# EAGLE design CANshield (EAGLE 5.10)
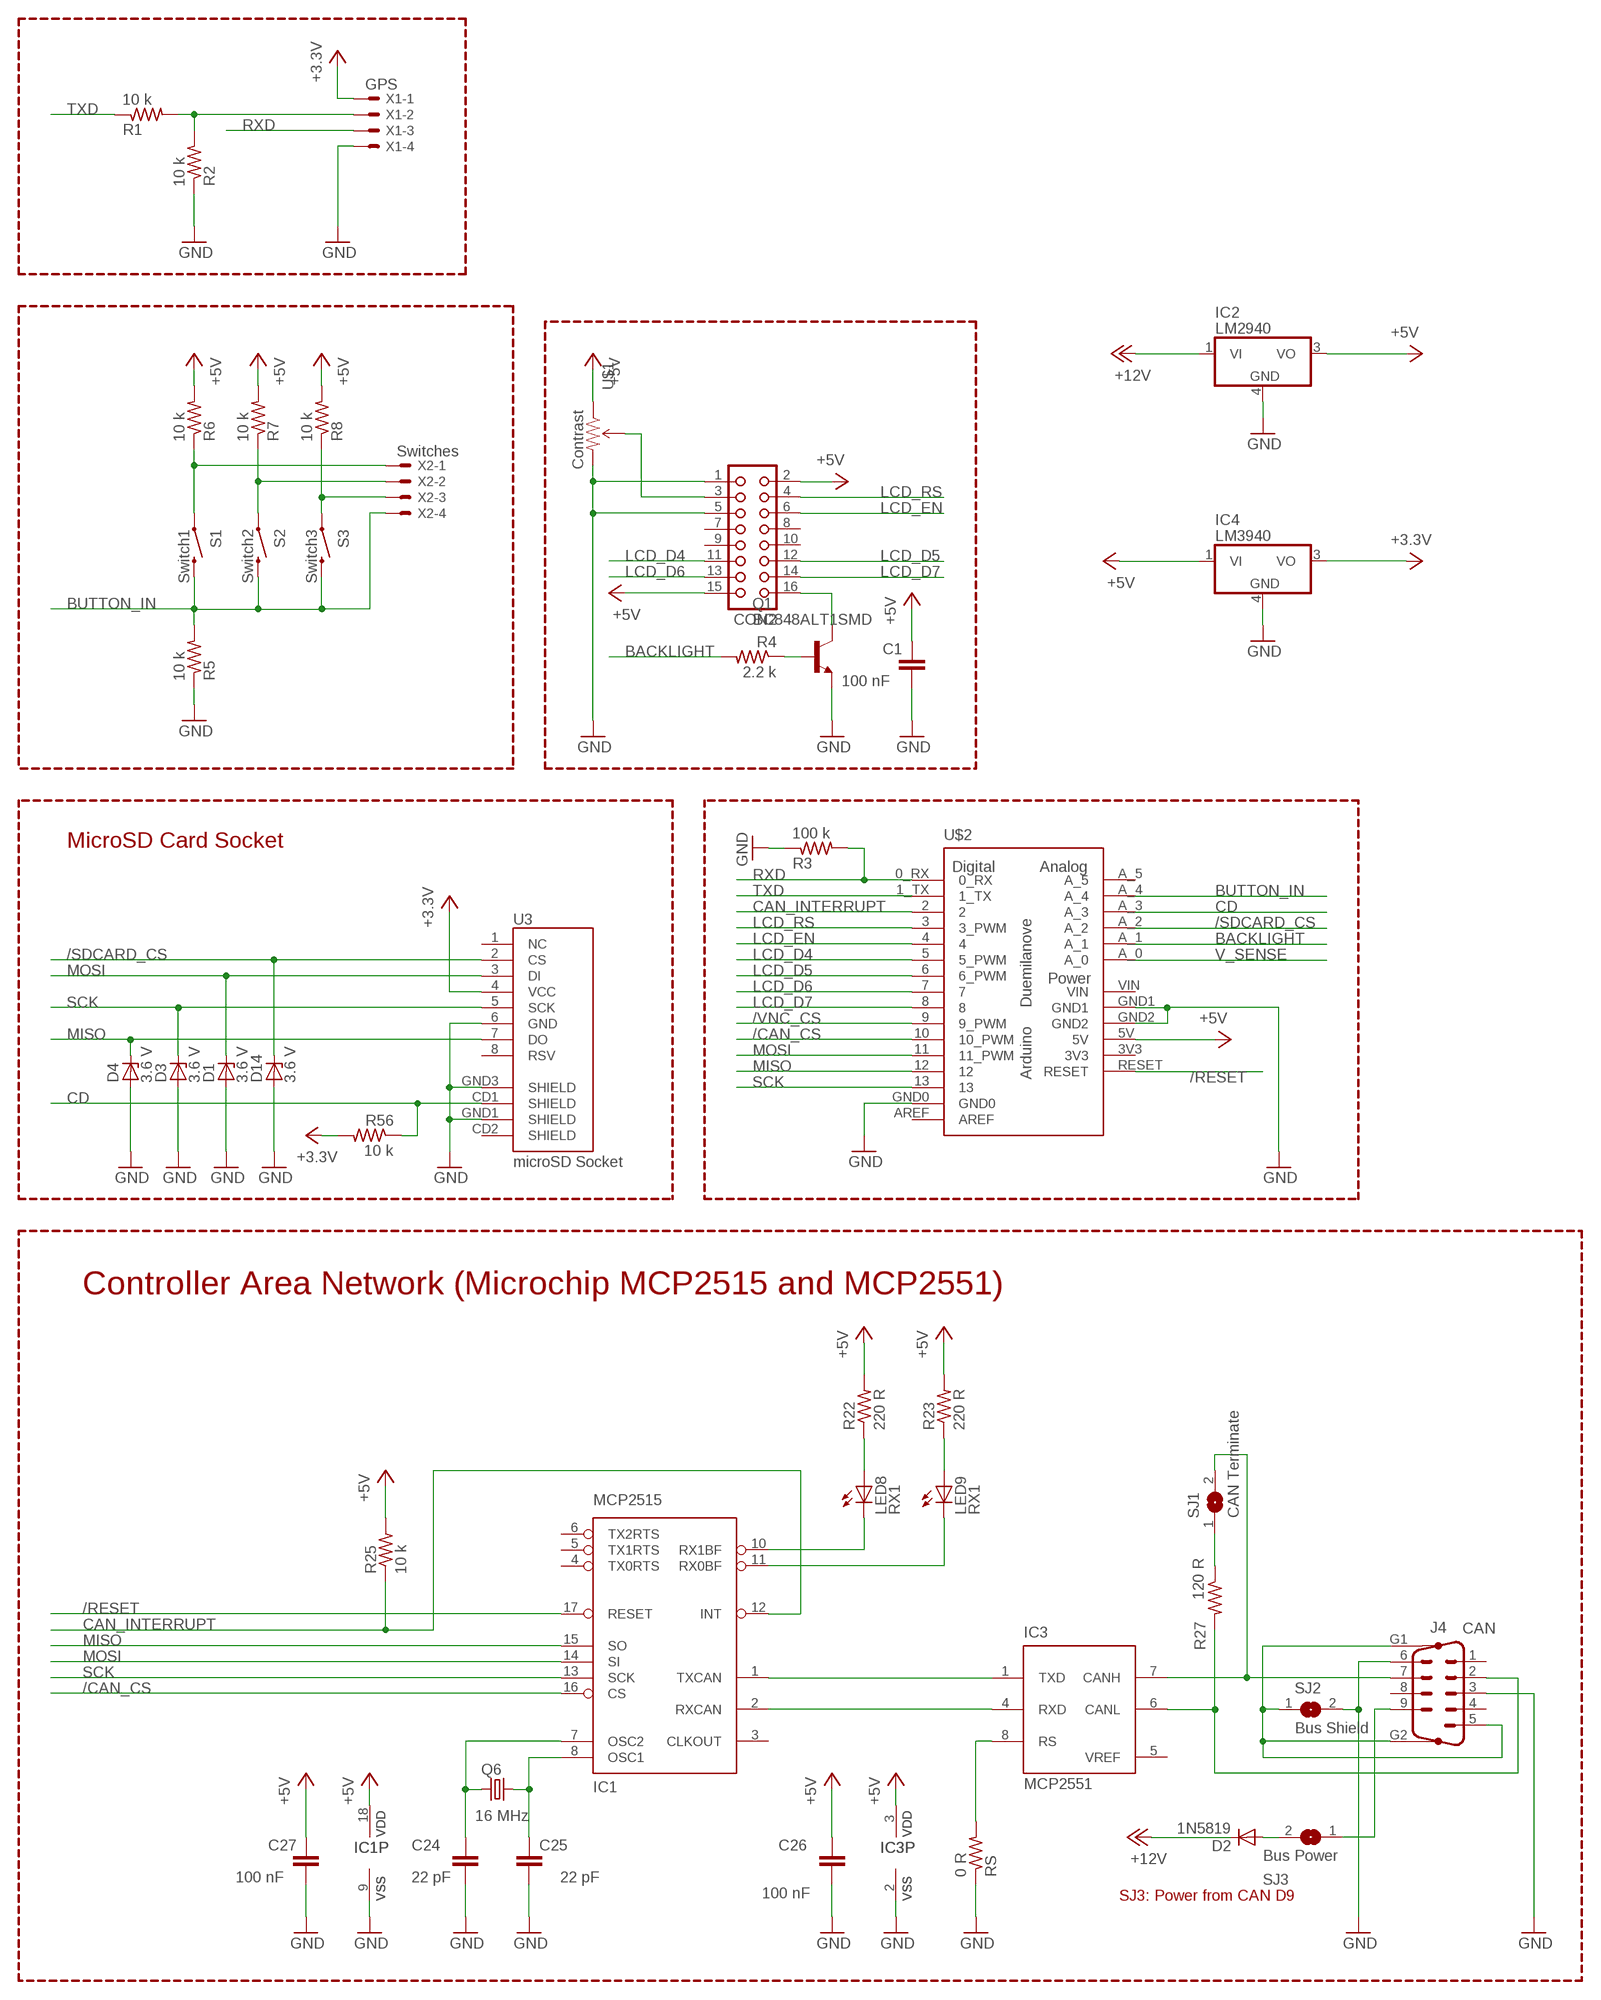
[diagram p0: schematic, sheet 1]

## Parts
C1  100 nF  C-EUC0805  [C0805]
C24  22 pF  C-EUC0805  [C0805]
C25  22 pF  C-EUC0805  [C0805]
C26  100 nF  C-EUC0805  [C0805]
C27  100 nF  C-EUC0805  [C0805]
CON2  CON16L  [CON16L]
D1  3.6 V  ZENER-DIODESOD80C  [SOD80C]
D2  1N5819  DIODE-SOD123  [SOD123]
D3  3.6 V  ZENER-DIODESOD80C  [SOD80C]
D4  3.6 V  ZENER-DIODESOD80C  [SOD80C]
D14  3.6 V  ZENER-DIODESOD80C  [SOD80C]
IC1  MCP2515  MCP2510SO  [SO-18W]
IC2  LM2940  LM340MP-05  [SOT223]
IC3  MCP2551  MCP2551SN  [SO-08]
IC4  LM3940  LM340MP-05  [SOT223]
J4  CAN  M09HP  [M09HP]
LED8  RX1  LEDCHIP-LED0805  [CHIP-LED0805]
LED9  RX1  LEDCHIP-LED0805  [CHIP-LED0805]
Q1  BC848ALT1SMD  [SOT23]
Q6  16 MHz  CRYSTALHC49UP  [HC49UP]
R1  10 k  R-US_M0805  [M0805]
R2  10 k  R-US_M0805  [M0805]
R3  100 k  R-US_M0805  [M0805]
R4  2.2 k  R-US_M0805  [M0805]
R5  10 k  R-US_M0805  [M0805]
R6  10 k  R-US_M0805  [M0805]
R7  10 k  R-US_M0805  [M0805]
R8  10 k  R-US_M0805  [M0805]
R22  220 R  R-US_M0805  [M0805]
R23  220 R  R-US_M0805  [M0805]
R25  10 k  R-US_M0805  [M0805]
R27  120 R  R-US_M0805  [M0805]
R56  10 k  R-US_M0805  [M0805]
RS  0 R  R-US_M0805  [M0805]
S1  Switch1  SWITCH-MOMENTARY-2SMD  [TACTILE_SWITCH_SMD]
S2  Switch2  SWITCH-MOMENTARY-2SMD  [TACTILE_SWITCH_SMD]
S3  Switch3  SWITCH-MOMENTARY-2SMD  [TACTILE_SWITCH_SMD]
SJ1  CAN Terminate  SJ  [SJ]
SJ2  Bus Shield  SJ  [SJ]
SJ3  Bus Power  SJ  [SJ]
U3  microSD Socket  USD-SOCKETNEW  [MICRO-SD-SOCKET-PP]
U$1  Contrast  TRIMPOTSMD  [TRIMPOT-3MM]
U$2  ARDUINO-USBLONG_PADS_TEXT  [SHIELD]
X1  GPS  22-23-2041  [22-23-2041]
X2  Switches  22-23-2041  [22-23-2041]

## Nets
+3V3: IC4.3(VO) R56.2 U3.4(VCC) X1.1 ; supply symbol labelled +3.3V
+5V: C1.2 C26.2 C27.2 CON2.2 CON2.15 IC1.18(VDD) IC2.3(VO) IC3.3(VDD) IC4.1(VI) R6.2 R7.2 R8.2 R22.2 R23.2 R25.2 U$1.1(CCW) U$2.5V
+12V: D2.C IC2.1(VI)
/CAN_CS: IC1.16(CS) U$2.10(10_PWM)
/RESET: IC1.17(RESET) U$2.RESET
/SDCARD_CS: D14.C U3.2(CS) U$2.A_2
/VNC_CS: U$2.9(9_PWM)
BACKLIGHT: R4.2 U$2.A_1
BUTTON_IN: R5.2 S1.3 S2.3 S3.3 U$2.A_4 X2.4
CAN_INTERRUPT: IC1.12(INT) R25.1 U$2.2
CD: U3.CD1(SHIELD) U$2.A_3
GND: C1.1 C24.1 C25.1 C26.1 C27.1 CON2.1 CON2.5 D1.A D3.A D4.A D14.A IC1.9(VSS) IC2.4(GND) IC3.2(VSS) IC4.4(GND) J4.3 J4.6 Q1.2(E) R2.1 R3.1 R5.1 RS.1 SJ2.2 U3.6(GND) U3.GND1(SHIELD) U3.GND3(SHIELD) U$1.3(CW) U$2.GND0 U$2.GND1 U$2.GND2 X1.4
GPS_RX: R1.2 R2.2 X1.2
LCD_D4: CON2.11 U$2.5(5_PWM)
LCD_D5: CON2.12 U$2.6(6_PWM)
LCD_D6: CON2.13 U$2.7
LCD_D7: CON2.14 U$2.8
LCD_EN: CON2.6 U$2.4
LCD_RS: CON2.4 U$2.3(3_PWM)
MISO: D4.C IC1.15(SO) U3.7(DO) U$2.12
MOSI: D1.C IC1.14(SI) U3.3(DI) U$2.11(11_PWM)
N$3: Q1.1(B) R4.1
N$4: R6.1 S1.1 X2.1
N$5: CON2.3 U$1.2(WIPER)
N$6: R7.1 S2.1 X2.2
N$7: R8.1 S3.1 X2.3
N$9: CON2.16 Q1.3(C)
N$11: R56.1
N$77: IC1.1(TXCAN) IC3.1(TXD)
N$78: IC1.2(RXCAN) IC3.4(RXD)
N$85: C25.2 IC1.8(OSC1) Q6.1
N$88: C24.2 IC1.7(OSC2) Q6.2
N$89: IC1.11(RX0BF) LED9.C
N$90: IC1.10(RX1BF) LED8.C
N$91: LED9.A R23.1
N$92: LED8.A R22.1
N$93: IC3.8(RS) RS.2
N$94: IC3.7(CANH) J4.7 SJ1.2
N$95: IC3.6(CANL) J4.2 R27.2
N$101: J4.5 J4.G1 J4.G2 SJ2.1
N$111: J4.9 SJ3.1
N$112: D2.A SJ3.2
N$123: R27.1 SJ1.1
RXD: R3.2 U$2.0_RX X1.3
SCK: D3.C IC1.13(SCK) U3.5(SCK) U$2.13
TXD: R1.1 U$2.1_TX
V_SENSE: U$2.A_0
Unconnected: CON2.7 CON2.8 CON2.9 CON2.10 IC1.3(CLKOUT) IC1.4(TX0RTS) IC1.5(TX1RTS) IC1.6(TX2RTS) J4.1 J4.4 J4.8 U3.1(NC) U3.8(RSV) U3.CD2(SHIELD) U$2.A_5 U$2.AREF

## Notes on the sheet
- MicroSD Card Socket
- Controller Area Network (Microchip MCP2515 and MCP2551)
- SJ3: Power from CAN D9

## Power pins joined to a net without a drawn wire
3V3: U$2.3V3
VIN: U$2.VIN
VREF: IC3.5(VREF)

## Library data of the parts
C1 C24-C27 = rcl:C-EU: CAPACITOR, European symbol
CON2 = con-harting:CON16L: CONNECTOR
D1 D3 D4 D14 = diode:ZENER-DIODE: Z-Diode
D2 = diode:DIODE-: DIODE
IC1 = microchip_can:MCP2510
IC2 IC4 = linear:LM340?-*: Positive VOLTAGE REGULATOR Source: http://cache.national.com/ds/LM/LM340.pdf
IC3 = microchip_can:MCP2551: High Speed CAN tranceiver
J4 = con-subd:M09HP: SUB-D
LED8 LED9 = led:LED: LED OSRAM: - CHIPLED LG R971, LG N971, LY N971, LG Q971, LY Q971, LO R971, LY R971 LH N974, LH R974 LS Q976, LO Q976, LY Q976 LO Q996 - Hyper CHIPLED LW Q18S LB Q993, LB Q99A, LB R99A - SideLED LS A670, LO A670, LY A670, LG A670, LP A670 LB A673, LV A673, LT A673, LW A673 LH A674 LY A675 LS A676, LA A676, LO A676, LY A676, LW A676 LS A679, LY A679, LG A679 - Hyper Micro SIDELED® LS Y876, LA Y876, LO Y876, LY Y876 LT Y87S - SmartLED LW L88C, LW L88S LB L89C, LB L89S, LG L890 LS L89K, LO L89K, LY L89K LS L896, LA L896, LO L896, LY L896 - TOPLED LS T670, LO T670, LY T670, LG T670, LP T670 LSG T670, LSP T670, LSY T670, LOP T670, LYG T670 LG T671, LOG T671, LSG T671 LB T673, LV T673, LT T673, LW T673 LH T674 LS T676, LA T676, LO T676, LY T676, LB T676, LH T676, LSB T676, LW T676 LB T67C, LV T67C, LT T67C, LS T67K, LO T67K, LY T67K, LW E67C LS E67B, LA E67B, LO E67B, LY E67B, LB E67C, LV E67C, LT E67C LW T67C LS T679, LY T679, LG T679 LS T770, LO T770, LY T770, LG T770, LP T770 LB T773, LV T773, LT T773, LW T773 LH T774 LS E675, LA E675, LY E675, LS T675 LS T776, LA T776, LO T776, LY T776, LB T776 LHGB T686 LT T68C, LB T68C - Hyper Mini TOPLED® LB M676 - Mini TOPLED Santana® LG M470 LS M47K, LO M47K, LY M47K Source: http://www.osram.convergy.de LUXEON: - LUMILED® LXK2-PW12-R00, LXK2-PW12-S00, LXK2-PW14-U00, LXK2-PW14-V00 LXK2-PM12-R00, LXK2-PM12-S00, LXK2-PM14-U00 LXK2-PE12-Q00, LXK2-PE12-R00, LXK2-PE12-S00, LXK2-PE14-T00, LXK2-PE14-U00 LXK2-PB12-K00, LXK2-PB12-L00, LXK2-PB12-M00, LXK2-PB14-N00, LXK2-PB14-P00, LXK2-PB14-Q00 LXK2-PR12-L00, LXK2-PR12-M00, LXK2-PR14-Q00, LXK2-PR14-R00 LXK2-PD12-Q00, LXK2-PD12-R00, LXK2-PD12-S00 LXK2-PH12-R00, LXK2-PH12-S00 LXK2-PL12-P00, LXK2-PL12-Q00, LXK2-PL12-R00 Source: www.luxeon.com KINGBRIGHT: KA-3528ASYC Source: www.kingbright.com
Q1 = transistor-npn:BC848*: NPN Transistor
Q6 = crystal:CRYSTAL: CRYSTAL
R1-R8 R22 R23 R25 R27 R56 RS = rcl:R-US_: RESISTOR, American symbol
S1-S3 = SparkFun:SWITCH-MOMENTARY-2
SJ1-SJ3 = jumper:SJ: SMD solder JUMPER
U3 = SparkFun:USD-SOCKET: microSD Socket Push-push type uSD socket. Schematic element and footprint production proven. Spark Fun Electronics SKU : PRT-00127. tDoc lines correctly indicate media card edge positions when inserting (unlocked, locked, depressed).
U$1 = SparkFun:TRIMPOT
U$2 = Arduino-Various:ARDUINO-USB: The Ardiuno Duemilanove Pinouts layoutet as a Bare Shield. v0.5 Also for Arduino Diecimila. This is designed as a Part and has no Outline in the Dimension Layer. The Outline, when present, is drawed at the tPlace / bPlace Layer. Library by Stephanie Lange, http://www.k-ita.de/~sl/
X1 X2 = con-molex:22-23-2041: .100" (2.54mm) Center Header - 4 Pin

## Board
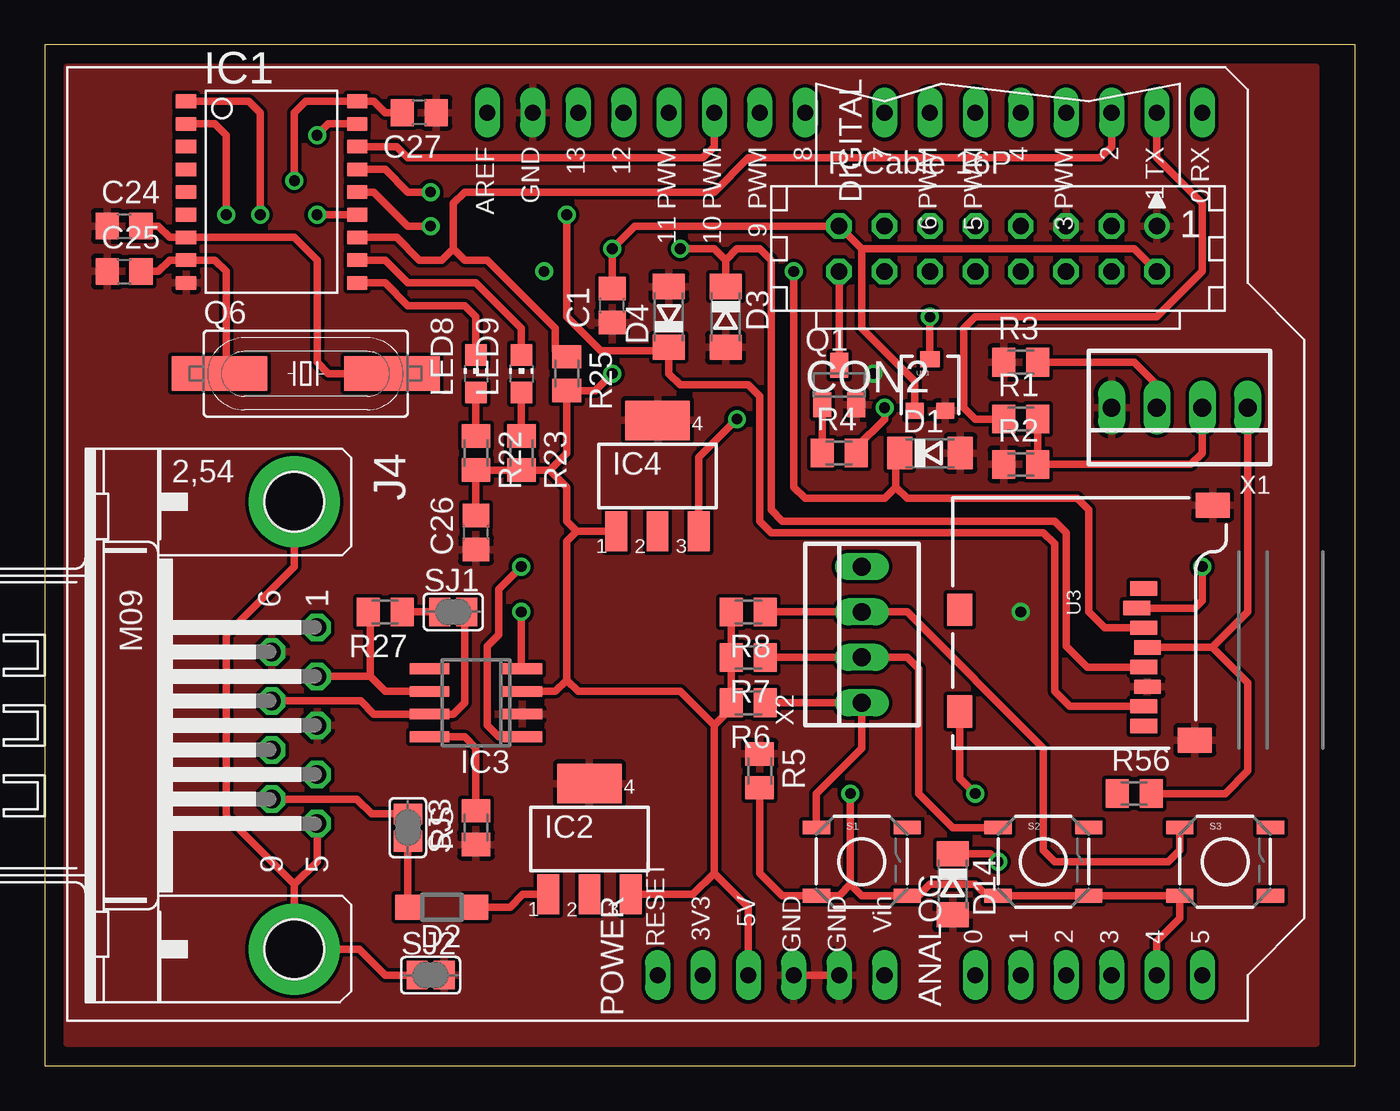
[diagram p1: board, top side]
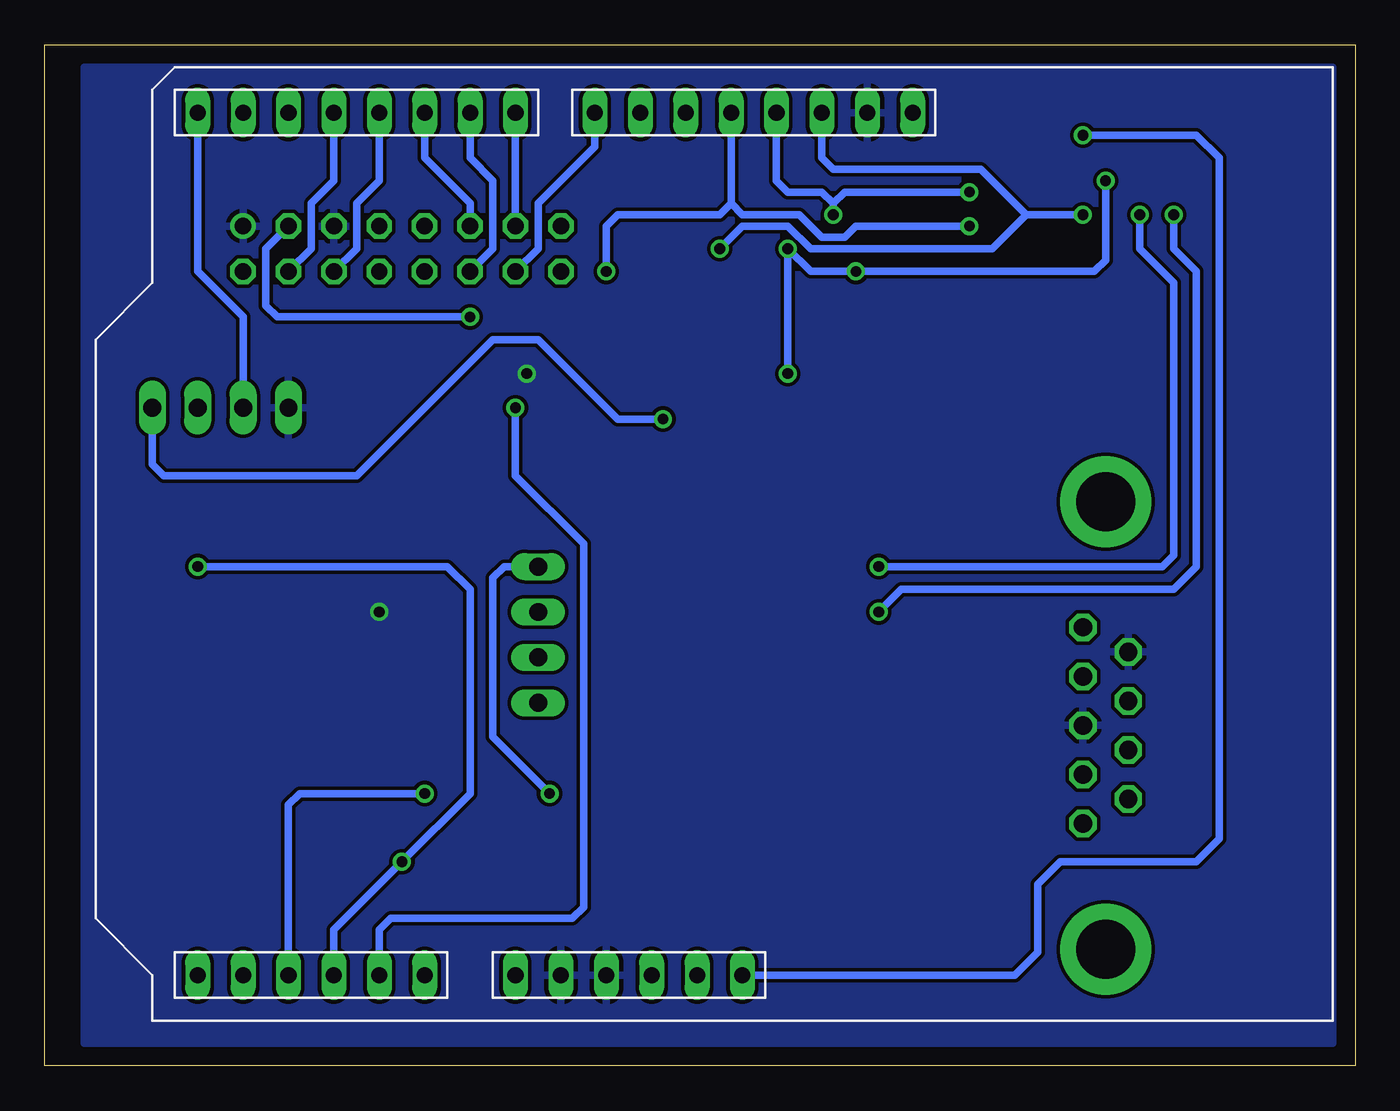
[diagram p2: board, bottom side, seen from below]

Size 73.33 x 57.14 mm. Coordinates in mm from the lower left corner, seen from the top.
Outline: 0,0 73.33,0 73.33,57.14 0,57.14 0,0
Copper layers (1*16): Top 0.035mm / dielectric 1.5mm / Bottom 0.035mm
Design rules "default": minimum track width 10mil, minimum drill 24mil, track to track 8mil, track to pad 8mil, pad to pad 8mil, via to via 8mil, smd to smd 8mil, copper to edge 40mil, drill to drill 8mil, minimum pad ring 10mil, minimum via ring 8mil, stop-mask expansion 4mil, vias tented up to drill 0mil, thermal gap 10mil

### Footprints (pad centres in the part's own frame; a part is rotated, then mirrored left to right if it is on the bottom)
C0805 = smd 1.3 x 1.5: 1 -0.95,0; 2 0.95,0
CON16L = drill 0.914 round: 1 8.89,1.27 | drill 0.914 octagon: 2 8.89,-1.27; 3 6.35,1.27; 4 6.35,-1.27; 5 3.81,1.27; 6 3.81,-1.27; 7 1.27,1.27; 8 1.27,-1.27; 9 -1.27,1.27; 10 -1.27,-1.27; 11 -3.81,1.27; 12 -3.81,-1.27; 13 -6.35,1.27; 14 -6.35,-1.27; 15 -8.89,1.27; 16 -8.89,-1.27
SOD80C = smd 1.4 x 1.8: A 1.7,0; C -1.7,0
SOD123 = smd 1.4 x 1.4: A 1.9,0; C -1.9,0
SO-18W = smd 0.762 x 1.143: 1 -5.08,-4.788; 2 -3.81,-4.788; 3 -2.54,-4.788; 4 -1.27,-4.788; 5 0,-4.788; 6 1.27,-4.788; 7 2.54,-4.788; 8 3.81,-4.788; 9 5.08,-4.788; 10 5.08,4.788; 11 3.81,4.788; 12 2.54,4.788; 13 1.27,4.788; 14 0,4.788; 15 -1.27,4.788; 16 -2.54,4.788; 17 -3.81,4.788; 18 -5.08,4.788
SOT223 = smd 1.219 x 2.235: 1 -2.311,-3.099; 2 0,-3.099; 3 2.311,-3.099 | smd 3.6 x 2.2: 4 0,3.099
SO-08 = smd 0.6 x 2.2: 1 -1.905,-2.6; 2 -0.635,-2.6; 3 0.635,-2.6; 4 1.905,-2.6; 5 1.905,2.6; 6 0.635,2.6; 7 -0.635,2.6; 8 -1.905,2.6
M09HP = drill 1.016 octagon: 1 -5.486,1.27; 2 -2.743,1.27; 3 0,1.27; 4 2.743,1.27; 5 5.486,1.27; 6 -4.115,-1.27; 7 -1.372,-1.27; 8 1.372,-1.27; 9 4.115,-1.27 | drill 3.302 pad 5.08 round: G1 -12.522,0; G2 12.522,0
CHIP-LED0805 = smd 1.2 x 1.2: A 0,-1.05; C 0,1.05
SOT23 = smd 1 x 1.4: 1 -0.95,-1.1; 2 0.95,-1.1; 3 0,1.1
HC49UP = smd 5.334 x 1.93: 1 -4.826,0; 2 4.826,0
M0805 = smd 1.3 x 1.6: 1 -0.95,0; 2 0.95,0
TACTILE_SWITCH_SMD = smd 1.524 x 0.762: 1 -2.54,1.905; 2 2.54,1.905; 3 -2.54,-1.905; 4 2.54,-1.905
SJ = smd 1.168 x 1.6: 1 -0.762,0; 2 0.762,0
MICRO-SD-SOCKET-PP = smd 0.8 x 1.5: 1 -8.94,10.7; 2 -7.84,10.3; 3 -6.74,10.7; 4 -5.64,10.9; 5 -4.54,10.7; 6 -3.44,10.9; 7 -2.34,10.7; 8 -1.24,10.7 | smd 1.8 x 1.4: CD1 -2.05,0.4; CD2 -7.75,0.4 | smd 1.4 x 1.9: GND1 -13.6,14.55; GND3 -0.45,13.55
TRIMPOT-3MM = smd 1 x 0.9: 1 -0.85,-1.45; 3 0.85,-1.45 | smd 1.1 x 0.9: 2 0,1.45
SHIELD = drill 0.9 pad 1.27 long: 0_RX -25.4,27.94; 1_TX -25.4,25.4; 2 -25.4,22.86; 3 -25.4,20.32; 3V3 22.86,0; 4 -25.4,17.78; 5 -25.4,15.24; 5V 22.86,2.54; 6 -25.4,12.7; 7 -25.4,10.16; 8 -25.4,5.715; 9 -25.4,3.175; 10 -25.4,0.635; 11 -25.4,-1.905; 12 -25.4,-4.445; 13 -25.4,-6.985; A_0 22.86,15.24; A_1 22.86,17.78; A_2 22.86,20.32; A_3 22.86,22.86; A_4 22.86,25.4; A_5 22.86,27.94; AREF -25.4,-12.065; GND0 -25.4,-9.525; GND1 22.86,7.62; GND2 22.86,5.08; RESET 22.86,-2.54; VIN 22.86,10.16
22-23-2041 = drill 1 long: 1 -3.81,0; 2 -1.27,0; 3 1.27,0; 4 3.81,0

### Placement (x,y rotation side)
C1  31.75,42.54 90 top
C24  4.45,46.99 0 top
C25  4.45,44.45 0 top
C26  24.13,29.84 90 top
C27  20.96,53.34 180 top
CON2  53.34,45.72 0 top
D1  49.53,34.29 0 top
D2  22.23,8.89 180 top
D3  38.1,41.91 270 top
D4  34.92,41.91 90 top
D14  50.8,10.16 270 top
IC1  12.7,48.89 270 top
IC2  30.48,12.7 0 top
IC3  24.13,20.32 90 top
IC4  34.29,33.02 0 top
J4  13.97,19.05 270 top
LED8  24.13,38.73 0 top
LED9  26.67,38.73 0 top
Q1  44.45,38.1 0 top
Q6  14.61,38.73 0 top
R1  54.61,36.2 0 top
R2  54.61,33.65 0 top
R3  54.61,39.37 0 top
R4  44.45,34.29 0 top
R5  40,16.51 270 top
R6  39.37,20.32 180 top
R7  39.37,22.86 180 top
R8  39.37,25.4 180 top
R22  24.13,34.29 270 top
R23  26.67,34.29 270 top
R25  29.21,38.73 270 top
R27  19.05,25.4 180 top
R56  60.96,15.24 0 top
RS  24.13,13.34 90 top
S1  45.72,11.43 0 top
S2  55.88,11.43 0 top
S3  66.04,11.43 0 top
SJ1  22.86,25.4 0 top
SJ2  21.59,5.08 0 top
SJ3  20.32,13.34 270 top
U3  50.8,17.78 270 top
U$1  49.53,38.1 0 top
U$2  36.83,27.94 270 top
X1  63.5,36.83 180 top
X2  45.72,24.13 90 top

### Tracks (layer width: path | path; a pad name or v marks a point on that pad's centre or on a via)
+3V3  (via drill 0.6)
  Top 0.406: 65.33,23.42 U3.4 | 65.33,23.42 67.31,25.4 X1.1 | R56.2 66.04,15.24 67.31,16.51 67.31,21.44 65.33,23.42 | IC4.3 36.6,34.06 v38.73,36.2
  Bottom 0.406: v38.73,36.2 41.27,36.2 45.72,40.64 48.26,40.64 55.88,33.02 66.67,33.02 67.31,33.65 X1.1
+5V  (via drill 0.6)
  Top 0.406: C27.2 19.05,53.34 18.41,53.97 IC1.18 14.61,53.97 13.97,53.34 v13.97,49.53 | 28.26,33.34 R23.2 R22.2 C26.2 | 28.26,33.34 29.21,34.29 R25.2 30.8,37.78 v31.75,38.73 | 45.72,45.72 CON2.15 33.02,46.99 v31.75,45.72 C1.2 | 45.72,45.72 60.96,45.72 CON2.2 | 28.26,33.34 29.21,32.39 29.21,30.48 29.77,29.92 | 29.21,21.59 28.57,20.96 IC3.3 | 45.72,45.72 45.72,41.27 48.68,38.31 U$1.1 | R8.2 R7.2 R6.2 38.42,20 37.46,19.05 | U$2.5V 39.37,8.89 37.46,10.79 | 37.46,10.79 37.46,19.05 | 29.21,21.59 29.84,20.96 35.56,20.96 37.46,19.05 | 29.77,29.92 IC4.1 | 29.21,21.59 29.21,29.36 29.77,29.92 | IC2.3 36.27,9.6 37.46,10.79
  Bottom 0.406: v13.97,49.53 13.97,45.08 14.61,44.45 v27.94,44.45 30.48,44.45 v31.75,45.72 v31.75,38.73
+12V
  Top 0.406: D2.C 26.04,8.89 26.75,9.6 IC2.1
/CAN_CS
  Top 0.406: IC1.16 19.68,51.43 20.32,50.8 36.83,50.8 37.46,51.43 U$2.10
/RESET  (via drill 0.6)
  Top 0.406: IC1.17 15.88,52.7 v15.24,52.07
  Bottom 0.406: U$2.RESET 19.05,5.08 17.78,6.35 17.78,10.16 16.51,11.43 8.89,11.43 7.62,12.7 7.62,50.8 8.89,52.07 v15.24,52.07
/SDCARD_CS  (via drill 0.6)
  Top 0.406: U3.2 64.36,25.62 64.77,26.04 v64.77,27.94 | D14.C 52.91,11.86 v53.34,11.43
  Bottom 0.406: U$2.A_2 57.15,7.62 v53.34,11.43 49.53,15.24 49.53,26.67 50.8,27.94 v64.77,27.94
BACKLIGHT  (via drill 0.6)
  Top 0.406: R4.2 45.4,34.6 46.99,36.2 v46.99,36.83
  Bottom 0.406: v46.99,36.83 46.99,33.02 43.18,29.21 43.18,8.89 43.81,8.26 53.97,8.26 54.61,7.62 U$2.A_1
BUTTON_IN  (via drill 0.6)
  Top 0.406: U$2.A_4 62.23,6.99 63.5,8.26 S3.3 S2.3 52.7,9.53 52.07,10.16 49.53,10.16 48.89,9.53 45.72,9.53 45.08,10.16 | 45.08,10.16 v45.08,15.24 | 45.08,10.16 44.45,9.53 S1.3 41.27,9.53 40,10.79 R5.2
  Bottom 0.406: X2.4 47.62,27.94 48.26,27.3 48.26,18.41 v45.08,15.24
CAN_INTERRUPT
  Top 0.406: U$2.2 59.69,51.43 59.05,50.8 39.37,50.8 37.46,48.89 23.5,48.89 22.86,48.26 22.86,45.72 | 22.86,45.72 23.5,45.08 24.77,45.08 28.57,41.27 28.57,40 28.89,39.68 R25.1 | 22.86,45.72 22.23,45.08 20.96,45.08 19.68,46.35 IC1.12
CD  (via drill 0.6)
  Top 0.406: U3.CD1 51.2,16.11 v52.07,15.24
  Bottom 0.406: v52.07,15.24 59.05,15.24 59.69,14.61 U$2.A_3
GND  (via drill 0.6)
  Top 0.406: U$2.GND2 U$2.GND1
  other vias: 46.35,38.73 54.61,25.4
  pour Bottom: 1.27,55.88 71.12,55.88 71.12,1.27 1.27,1.27
  pour Top: 1.27,55.88 71.12,55.88 71.12,1.27 1.27,1.27
GPS_RX
  Top 0.406: X1.2 64.77,34.29 64.14,33.65 R2.2 R1.2
LCD_D4
  Bottom 0.406: CON2.11 49.53,48.26 52.07,50.8 U$2.5
LCD_D5
  Bottom 0.406: CON2.12 48.26,45.72 48.26,49.53 49.53,50.8 U$2.6
LCD_D6
  Bottom 0.406: CON2.13 U$2.7
LCD_D7
  Bottom 0.406: U$2.8 42.54,51.43 45.72,48.26 45.72,45.72 CON2.14
LCD_EN
  Bottom 0.406: U$2.4 54.61,49.53 55.88,48.26 55.88,45.72 CON2.6
LCD_RS
  Bottom 0.406: U$2.3 57.15,49.53 58.42,48.26 58.42,45.72 CON2.4
MISO  (via drill 0.6)
  Top 0.406: IC1.15 19.05,50.16 20.32,48.89 v21.59,48.89 | U3.7 57.35,20.12 56.51,20.96 56.51,29.21 55.88,29.84 40.64,29.84 40,30.48 40,37.46 39.37,38.1 35.56,38.1 34.92,38.73 D4.C 34.72,40 31.11,40 29.21,41.91 v29.21,47.62
  Bottom 0.406: v21.59,48.89 28.57,48.89 29.21,48.26 | U$2.12 32.38,49.53 31.75,48.89 29.84,48.89 29.21,48.26 | 29.21,48.26 v29.21,47.62
MOSI  (via drill 0.6)
  Top 0.406: IC1.14 18.41,48.89 20.32,46.99 v21.59,46.99 | U3.3 59.3,24.52 58.42,25.4 58.42,31.11 57.78,31.75 48.26,31.75 47.62,32.38 | v41.91,44.45 41.91,32.38 42.54,31.75 46.99,31.75 47.62,32.38 | 47.62,32.38 47.62,34.08 D1.C
  Bottom 0.406: 34.92,48.26 34.29,47.62 31.11,47.62 29.84,46.35 28.57,46.35 27.94,46.99 v21.59,46.99 | 34.92,48.26 U$2.11 | 34.92,48.26 35.56,47.62 41.27,47.62 41.91,46.99 v41.91,44.45
N$3
  Top 0.406: R4.1 Q1.1
N$4
  Top 0.406: S1.1 43.18,15.24 45.72,17.78 X2.1 R6.1
N$5  (via drill 0.6)
  Top 0.406: U$1.2 v49.53,41.91
  Bottom 0.406: CON2.3 60.96,45.72 60.96,42.54 60.32,41.91 v49.53,41.91
N$6
  Top 0.406: R7.1 X2.2 48.26,22.86 48.89,22.23 48.89,15.24 50.8,13.34 S2.1
N$7
  Top 0.406: S3.1 63.5,12.07 62.87,11.43 56.51,11.43 55.88,12.07 55.88,17.78 48.26,25.4 X2.3 R8.1
N$9
  Top 0.406: Q1.3 CON2.16
N$77  (via drill 0.6)
  Top 0.406: IC3.1 25.4,18.41 24.77,19.05 24.77,23.5 25.4,24.13 25.4,26.67 v26.67,27.94 | IC1.1 11.43,53.97 12.07,53.34 v12.07,47.62
  Bottom 0.406: v26.67,27.94 10.79,27.94 10.16,28.57 10.16,43.81 12.07,45.72 v12.07,47.62
N$78  (via drill 0.6)
  Top 0.406: IC1.2 9.53,52.7 10.16,52.07 v10.16,47.62 | v26.67,25.4 26.67,22.29 IC3.4
  Bottom 0.406: v26.67,25.4 25.4,26.67 10.16,26.67 8.89,27.94 8.89,44.45 10.16,45.72 v10.16,47.62
N$85
  Top 0.406: Q6.1 10.16,39.12 10.16,44.45 9.53,45.08 IC1.8 6.99,45.08 6.35,44.45 C25.2
N$88
  Top 0.406: Q6.2 15.88,38.73 15.24,39.37 15.24,45.08 13.97,46.35 IC1.7 6.99,46.35 6.35,46.99 C24.2
N$89
  Top 0.406: IC1.11 19.05,45.08 20.32,43.81 24.13,43.81 26.67,41.27 LED9.C
N$90
  Top 0.406: IC1.10 19.05,43.81 20.32,42.54 23.5,42.54 24.13,41.91 LED8.C
N$91
  Top 0.406: R23.1 LED9.A
N$92
  Top 0.406: R22.1 LED8.A
N$93
  Top 0.406: IC3.8 23.5,18.41 24.13,17.78 RS.2
N$94
  Top 0.406: J4.7 17.68,20.42 18.41,19.68 IC3.7 22.86,19.68 23.5,20.32 23.5,25.27 SJ1.2
N$95
  Top 0.406: J4.2 18.21,21.79 | IC3.6 19.05,20.96 18.21,21.79 | 18.21,21.79 18.21,25.29 R27.2
N$101
  Top 0.406: 13.97,10.16 J4.G2 17.6,6.53 19.05,5.08 SJ2.1 | 13.97,10.16 15.24,11.43 J4.5 | J4.G1 13.97,27.94 10.16,24.13 10.16,13.97 13.97,10.16
N$111
  Top 0.406: J4.9 17.45,14.93 18.29,14.1 SJ3.1
N$112
  Top 0.406: SJ3.2 D2.A
N$123
  Top 0.406: R27.1 SJ1.1
RXD
  Top 0.406: X1.3 62.23,38.1 60.96,39.37 R3.2
  Bottom 0.406: U$2.0_RX 64.77,44.45 62.23,41.91 X1.3
SCK  (via drill 0.6)
  Top 0.406: v15.24,47.62 IC1.13 | U3.5 58.32,22.32 57.15,23.5 57.15,29.84 56.51,30.48 41.27,30.48 40.64,31.11 40.64,45.08 40,45.72 38.73,45.72 38.1,45.08 | 38.1,45.08 D3.C | v35.56,45.72 37.46,45.72 38.1,45.08
  Bottom 0.406: U$2.13 29.84,50.8 29.21,50.16 20.96,50.16 18.41,47.62 | v35.56,45.72 34.29,46.99 31.75,46.99 30.48,45.72 20.32,45.72 18.41,47.62 | v15.24,47.62 18.41,47.62
TXD
  Top 0.406: U$2.1_TX 62.23,50.8 64.77,48.26 64.77,44.45 62.23,41.91 52.07,41.91 51.43,41.27 51.43,36.83 52.07,36.2 R1.1